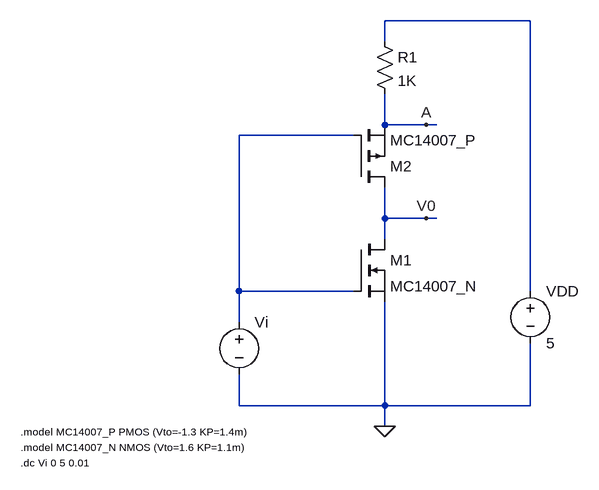
[diagram p0: schematic 1.3.1.asc]
1.3.1.asc, the LTspice schematic file:
Version 4
SHEET 1 880 680
WIRE 544 -272 320 -272
WIRE 320 -240 320 -272
WIRE 320 -112 320 -160
WIRE 384 -112 320 -112
WIRE 400 -112 384 -112
WIRE 272 -96 96 -96
WIRE 320 32 320 -16
WIRE 384 32 320 32
WIRE 400 32 384 32
WIRE 320 64 320 32
WIRE 96 144 96 -96
WIRE 272 144 96 144
WIRE 544 144 544 -272
WIRE 96 192 96 144
WIRE 96 320 96 272
WIRE 320 320 320 160
WIRE 320 320 96 320
WIRE 544 320 544 224
WIRE 544 320 320 320
WIRE 320 352 320 320
FLAG 320 352 0
FLAG 384 -112 A
FLAG 384 32 V0
SYMBOL voltage 96 176 R0
WINDOW 123 0 0 Left 0
WINDOW 39 0 0 Left 0
SYMATTR InstName Vi
SYMATTR Value ""
SYMBOL nmos 272 64 R0
SYMATTR InstName M1
SYMATTR Value MC14007_N
SYMBOL res 304 -256 R0
SYMATTR InstName R1
SYMATTR Value 1K
SYMBOL voltage 544 128 R0
WINDOW 123 0 0 Left 0
WINDOW 39 0 0 Left 0
SYMATTR InstName VDD
SYMATTR Value 5
SYMBOL pmos 272 -16 M180
SYMATTR InstName M2
SYMATTR Value MC14007_P
TEXT -240 360 Left 1 !.model MC14007_P PMOS (Vto=-1.3 KP=1.4m)
TEXT -240 384 Left 1 !.model MC14007_N NMOS (Vto=1.6 KP=1.1m)
TEXT -240 408 Left 1 !.dc Vi 0 5 0.01

The netlist it stands for:
* 1.3.1.asc
Vi N002 0
M1 V0 N002 0 0 MC14007_N
R1 N001 A 1K
VDD N001 0 5
M2 V0 N002 A A MC14007_P
.model NMOS NMOS
.model PMOS PMOS
.lib standard.mos
.model MC14007_P PMOS (Vto=-1.3 KP=1.4m)
.model MC14007_N NMOS (Vto=1.6 KP=1.1m)
.dc Vi 0 5 0.01
.backanno
.end

* Results of the author's LTspice run, read from the files saved beside the schematic
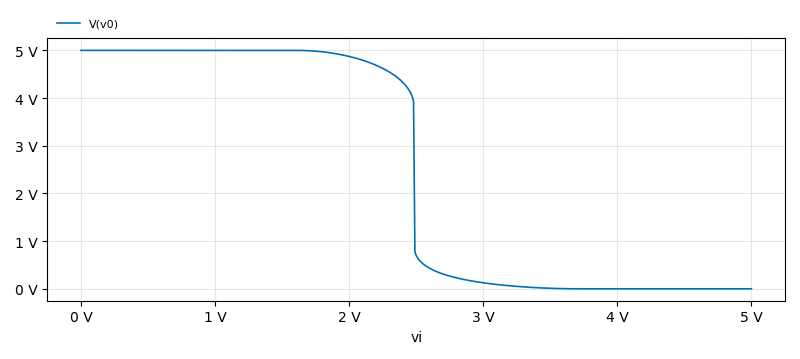
[diagram p1: DC transfer characteristic of 1.3.1.asc, plotted from the saved traces]
* DC transfer characteristic, 1 run:
*   V(v0): 5 V at vi=0 V, 2.676 nV at vi=5 V, min 2.676 nV, max 5 V